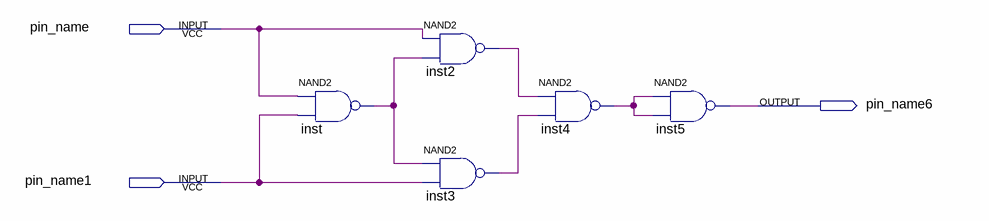
[diagram p0: schematic sheet]
// Quartus schematic Test1NAND.bdf as structural Verilog: 5 symbols, 3 pins
module Test1NAND (
  input  pin_name,
  input  pin_name1,
  output pin_name6
);

  wire inst2_out, inst3_out, inst4_out, inst_out;

  nand inst (inst_out, pin_name, pin_name1);
  nand inst2 (inst2_out, pin_name, inst_out);
  nand inst3 (inst3_out, inst_out, pin_name1);
  nand inst4 (inst4_out, inst2_out, inst3_out);
  nand inst5 (pin_name6, inst4_out, inst4_out);
endmodule
